# EAGLE design final board (EAGLE 7.6.0)
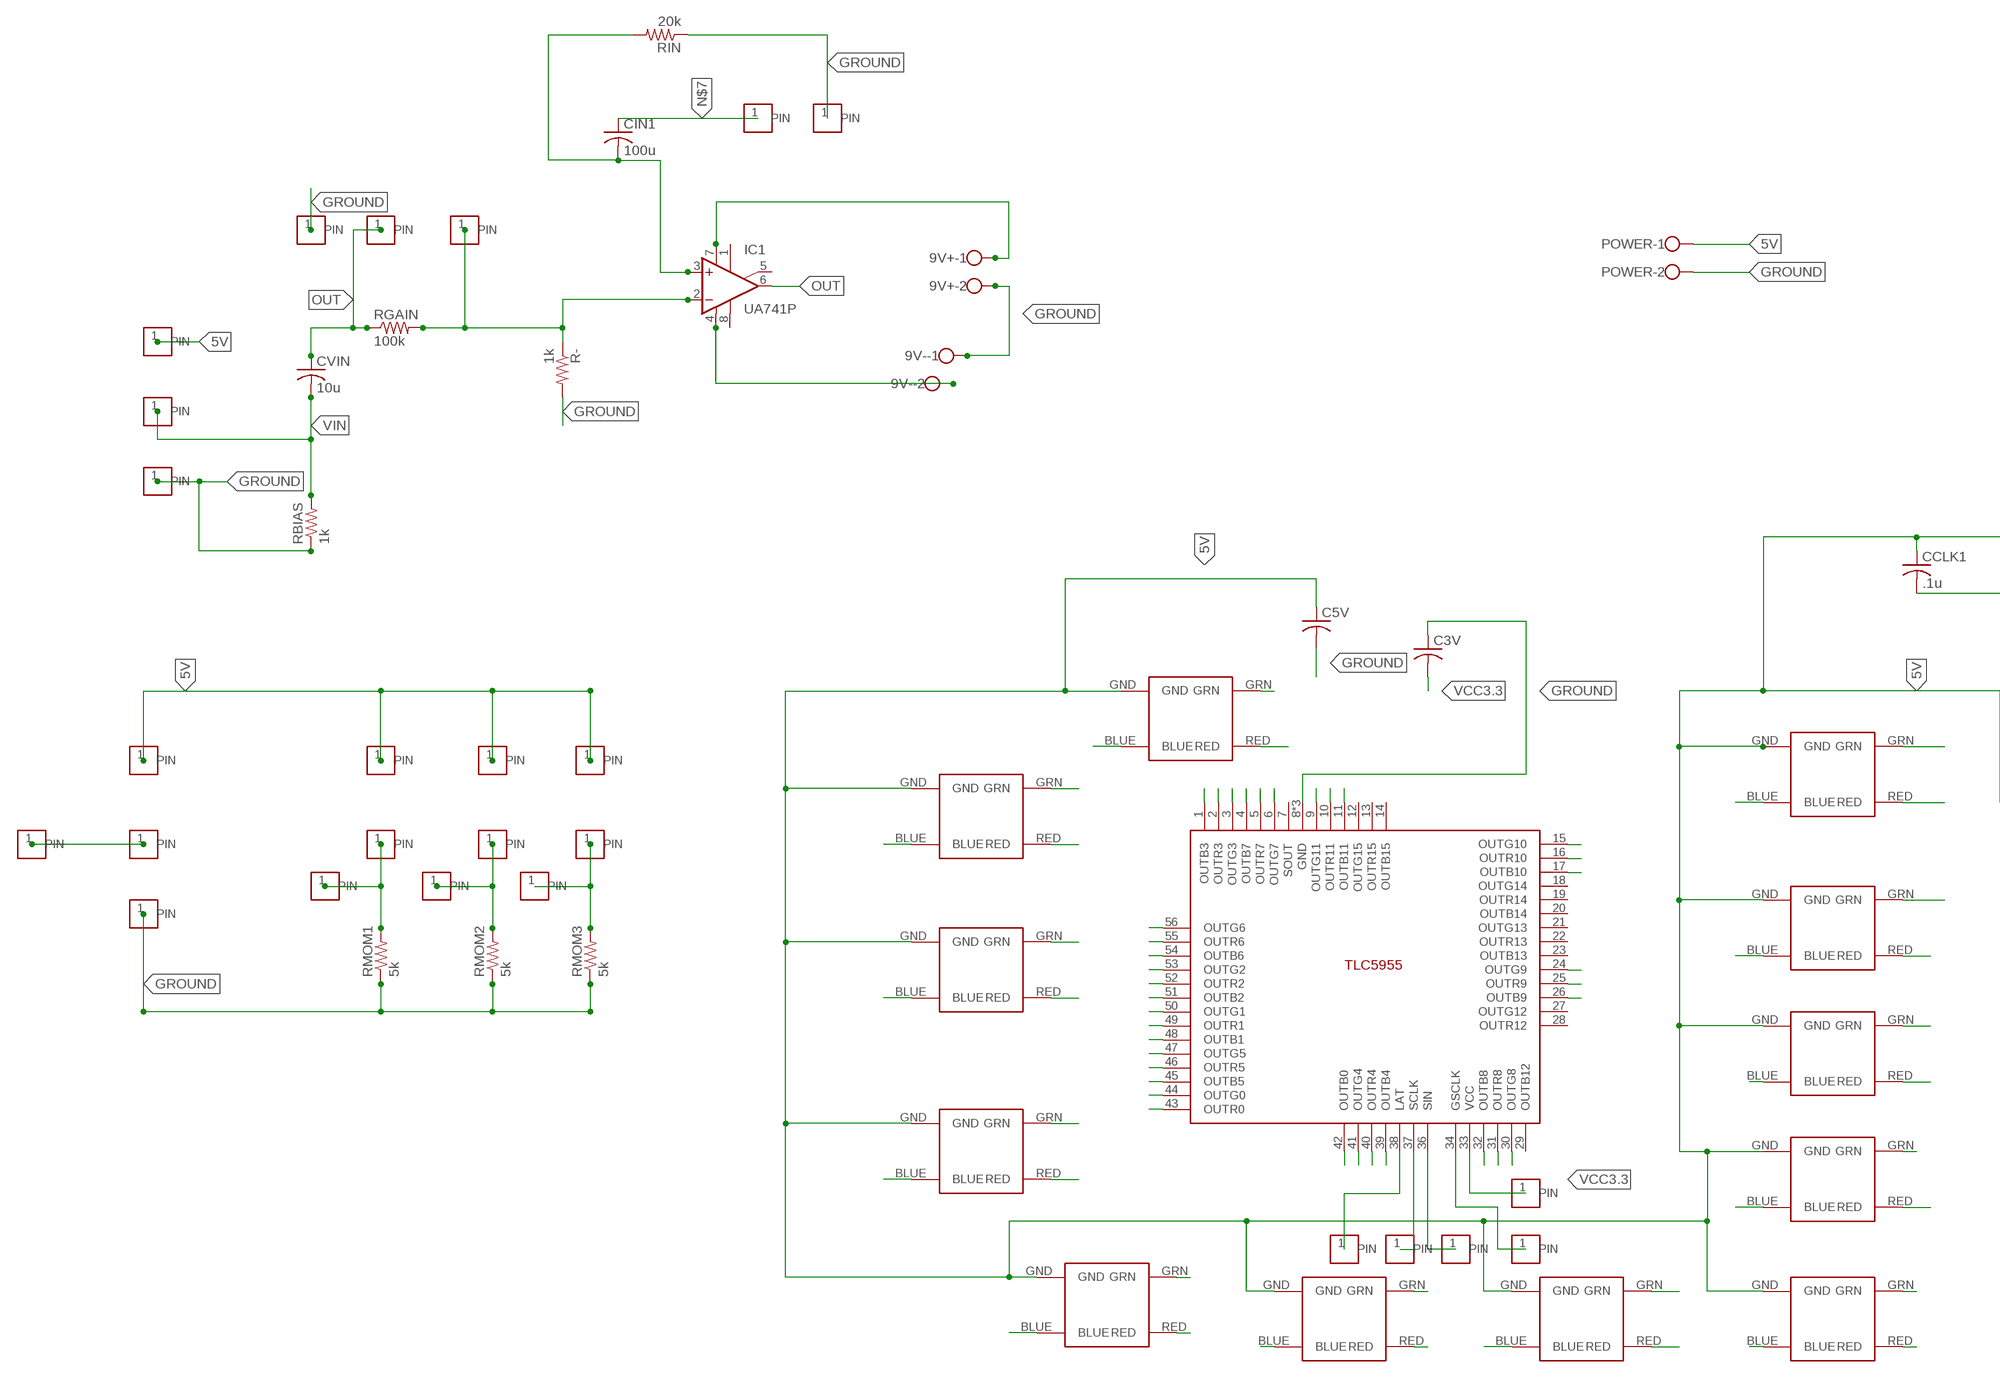
[diagram p0: schematic, sheet 1, part 1 of 2]
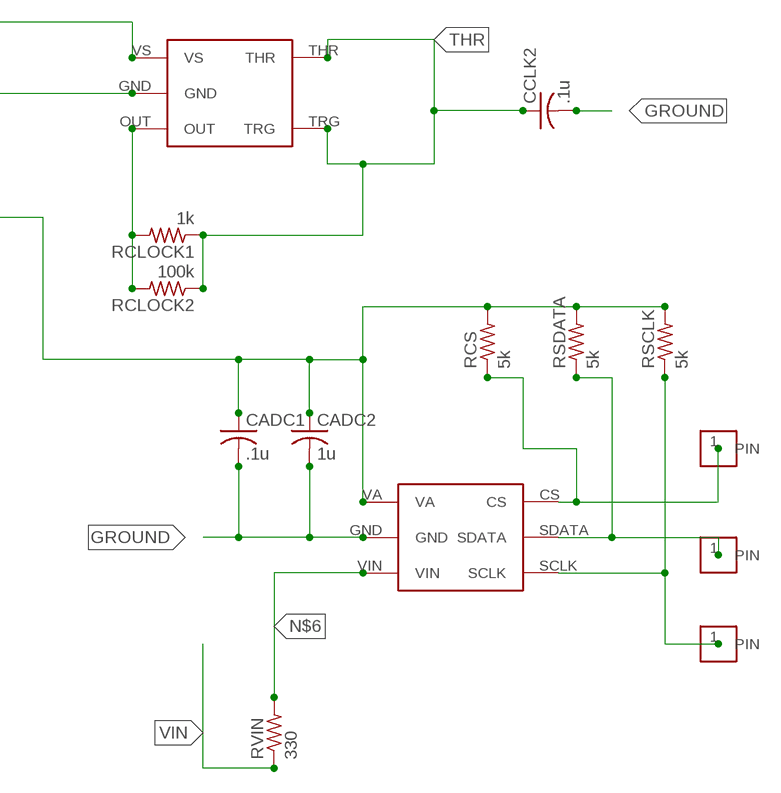
[diagram p1: schematic, sheet 1, part 2 of 2]

## Parts
3.3V  HEADERPIN_1  [HEADERPIN_1]
9V+  W237-102  [W237-102]
9V-  W237-102  [W237-102]
C3V  C-USC0805  [C0805]
C5V  C-USC0805  [C0805]
CADC1  .1u  C-USC0805  [C0805]
CADC2  1u  C-USC0805  [C0805]
CCLK1  .1u  C-USC0805  [C0805]
CCLK2  .1u  C-USC0805  [C0805]
CIN1  100u  C-USC0805  [C0805]
CS  HEADERPIN_1  [HEADERPIN_1]
CVIN  10u  C-USC0805  [C0805]
DATA  HEADERPIN_1  [HEADERPIN_1]
GSCLK  HEADERPIN_1  [HEADERPIN_1]
IC1  UA741P  [DIL08]
INPUTGND  HEADERPIN_1  [HEADERPIN_1]
INPUTV  HEADERPIN_1  [HEADERPIN_1]
INT1  HEADERPIN_1  [HEADERPIN_1]
INT2  HEADERPIN_1  [HEADERPIN_1]
INT3  HEADERPIN_1  [HEADERPIN_1]
LAT  HEADERPIN_1  [HEADERPIN_1]
MOMA1  HEADERPIN_1  [HEADERPIN_1]
MOMA2  HEADERPIN_1  [HEADERPIN_1]
MOMA3  HEADERPIN_1  [HEADERPIN_1]
MOMB1  HEADERPIN_1  [HEADERPIN_1]
MOMB2  HEADERPIN_1  [HEADERPIN_1]
MOMB3  HEADERPIN_1  [HEADERPIN_1]
POTAMPGND  HEADERPIN_1  [HEADERPIN_1]
POTAMPVAL  HEADERPIN_1  [HEADERPIN_1]
POTAMPVCC  HEADERPIN_1  [HEADERPIN_1]
POTBIAS5V  HEADERPIN_1  [HEADERPIN_1]
POTBIASGND  HEADERPIN_1  [HEADERPIN_1]
POTBIASVAL  HEADERPIN_1  [HEADERPIN_1]
POTLVL5V  HEADERPIN_1  [HEADERPIN_1]
POTLVLGND  HEADERPIN_1  [HEADERPIN_1]
POTLVLVAL  HEADERPIN_1  [HEADERPIN_1]
POTLVLVAL2  HEADERPIN_1  [HEADERPIN_1]
POWER  W237-102  [W237-102]
R-  1k  R-US_M0805  [M0805]
RBIAS  1k  R-US_M0805  [M0805]
RCLOCK1  1k  R-US_M0805  [M0805]
RCLOCK2  100k  R-US_M0805  [M0805]
RCS  5k  R-US_M0805  [M0805]
RGAIN  100k  R-US_M0805  [M0805]
RIN  20k  R-US_M0805  [M0805]
RMOM1  5k  R-US_M0805  [M0805]
RMOM2  5k  R-US_M0805  [M0805]
RMOM3  5k  R-US_M0805  [M0805]
RSCLK  5k  R-US_M0805  [M0805]
RSDATA  5k  R-US_M0805  [M0805]
RVIN  330  R-US_M0805  [M0805]
SCLK  HEADERPIN_1  [HEADERPIN_1]
SIN  HEADERPIN_1  [HEADERPIN_1]
SLK  HEADERPIN_1  [HEADERPIN_1]
TLC5955  TLC5954  [TLC5955]
U$1  MIC1555  [SOT-23]
U$2  KINGSBRIGHT_LED_3.5X2.8  [KINGSBRIGHT_LED_3.5X2.8]
U$3  KINGSBRIGHT_LED_3.5X2.8  [KINGSBRIGHT_LED_3.5X2.8]
U$4  KINGSBRIGHT_LED_3.5X2.8  [KINGSBRIGHT_LED_3.5X2.8]
U$5  KINGSBRIGHT_LED_3.5X2.8  [KINGSBRIGHT_LED_3.5X2.8]
U$6  KINGSBRIGHT_LED_3.5X2.8  [KINGSBRIGHT_LED_3.5X2.8]
U$7  KINGSBRIGHT_LED_3.5X2.8  [KINGSBRIGHT_LED_3.5X2.8]
U$8  KINGSBRIGHT_LED_3.5X2.8  [KINGSBRIGHT_LED_3.5X2.8]
U$9  KINGSBRIGHT_LED_3.5X2.8  [KINGSBRIGHT_LED_3.5X2.8]
U$10  KINGSBRIGHT_LED_3.5X2.8  [KINGSBRIGHT_LED_3.5X2.8]
U$11  KINGSBRIGHT_LED_3.5X2.8  [KINGSBRIGHT_LED_3.5X2.8]
U$12  KINGSBRIGHT_LED_3.5X2.8  [KINGSBRIGHT_LED_3.5X2.8]
U$13  KINGSBRIGHT_LED_3.5X2.8  [KINGSBRIGHT_LED_3.5X2.8]
U$14  ADC121S101  [SOT-23(6)]

## Nets
5V: C5V.1 CADC1.1 CADC2.1 CCLK1.1 MOMA1.1(PIN) MOMA2.1(PIN) MOMA3.1(PIN) POTBIAS5V.1(PIN) POTLVL5V.1(PIN) POWER.1 RCS.2 RSCLK.2 RSDATA.2 U$1.VS U$2.GND U$3.GND U$4.GND U$5.GND U$6.GND U$7.GND U$8.GND U$9.GND U$10.GND U$11.GND U$12.GND U$13.GND U$14.VA
B0: TLC5955.42(OUTB0) U$13.BLUE
B1: TLC5955.48(OUTB1) U$12.BLUE
B2: TLC5955.51(OUTB2) U$11.BLUE
B3: TLC5955.1(OUTB3) U$10.BLUE
B4: TLC5955.39(OUTB4) U$9.BLUE
B5: TLC5955.45(OUTB5) U$8.BLUE
B6: TLC5955.54(OUTB6) U$7.BLUE
B7: TLC5955.4(OUTB7) U$6.BLUE
B8: TLC5955.32(OUTB8) U$5.BLUE
B9: TLC5955.26(OUTB9) U$4.BLUE
B10: TLC5955.17(OUTB10) U$3.BLUE
B11: TLC5955.11(OUTB11) U$2.BLUE
G0: TLC5955.44(OUTG0) U$13.GRN
G1: TLC5955.50(OUTG1) U$12.GRN
G2: TLC5955.53(OUTG2) U$11.GRN
G3: TLC5955.3(OUTG3) U$10.GRN
G4: TLC5955.41(OUTG4) U$9.GRN
G5: TLC5955.47(OUTG5) U$8.GRN
G6: TLC5955.56(OUTG6) U$7.GRN
G7: TLC5955.6(OUTG7) U$6.GRN
G8: TLC5955.30(OUTG8) U$5.GRN
G9: TLC5955.24(OUTG9) U$4.GRN
G10: TLC5955.15(OUTG10) U$3.GRN
G11: TLC5955.9(OUTG11) U$2.GRN
GROUND: 9V+.2 9V-.1 C3V.1 C5V.2 CADC1.2 CADC2.2 CCLK1.2 CCLK2.2 INPUTGND.1(PIN) POTAMPGND.1(PIN) POTBIASGND.1(PIN) POTLVLGND.1(PIN) POWER.2 R-.2 RBIAS.1 RIN.1 RMOM1.1 RMOM2.1 RMOM3.1 TLC5955.8(GND) TLC5955.35(GND) TLC5955.HEATSINK(GND) U$1.GND U$14.GND
GSCLK: GSCLK.1(PIN) RCLOCK1.2 RCLOCK2.2 TLC5955.34(GSCLK) U$1.OUT
LAT: LAT.1(PIN) TLC5955.38(LAT)
N$1: CS.1(PIN) RCS.1 U$14.CS
N$2: INT1.1(PIN) MOMB1.1(PIN) RMOM1.2
N$3: RSCLK.1 SLK.1(PIN) U$14.SCLK
N$4: 9V+.1 IC1.7(V+)
N$5: 9V-.2 IC1.4(V-)
N$6: RVIN.2 U$14.VIN
N$7: CIN1.1 INPUTV.1(PIN)
N$8: CIN1.2 IC1.3(+IN) RIN.2
N$9: IC1.2(-IN) POTAMPVCC.1(PIN) R-.1 RGAIN.2
N$10: INT2.1(PIN) MOMB2.1(PIN) RMOM2.2
N$11: INT3.1(PIN) MOMB3.1(PIN) RMOM3.2
N$13: POTLVLVAL2.1(PIN) POTLVLVAL.1(PIN)
OUT: CVIN.1 IC1.6(OUT) POTAMPVAL.1(PIN) RGAIN.1
R0: TLC5955.43(OUTR0) U$13.RED
R1: TLC5955.49(OUTR1) U$12.RED
R2: TLC5955.52(OUTR2) U$11.RED
R3: TLC5955.2(OUTR3) U$10.RED
R4: TLC5955.40(OUTR4) U$9.RED
R5: TLC5955.46(OUTR5) U$8.RED
R6: TLC5955.55(OUTR6) U$7.RED
R7: TLC5955.5(OUTR7) U$6.RED
R8: TLC5955.31(OUTR8) U$5.RED
R9: TLC5955.25(OUTR9) U$4.RED
R10: TLC5955.16(OUTR10) U$3.RED
R11: TLC5955.10(OUTR11) U$2.RED
SCLK: SCLK.1(PIN) TLC5955.37(SCLK)
SDATA: DATA.1(PIN) RSDATA.1 U$14.SDATA
SIN: SIN.1(PIN) TLC5955.36(SIN)
THR: CCLK2.1 RCLOCK1.1 RCLOCK2.1 U$1.THR U$1.TRG
VCC3.3: 3.3V.1(PIN) C3V.2 TLC5955.33(VCC)
VIN: CVIN.2 POTBIASVAL.1(PIN) RBIAS.2 RVIN.1
Unconnected: IC1.1(ON1) IC1.5(ON2) IC1.8(OPT) TLC5955.7(SOUT) TLC5955.12(OUTG15) TLC5955.13(OUTR15) TLC5955.14(OUTB15) TLC5955.18(OUTG14) TLC5955.19(OUTR14) TLC5955.20(OUTB14) TLC5955.21(OUTG13) TLC5955.22(OUTR13) TLC5955.23(OUTB13) TLC5955.27(OUTG12) TLC5955.28(OUTR12) TLC5955.29(OUTB12)

## Library data of the parts
3.3V CS DATA GSCLK INPUTGND INPUTV INT1-INT3 LAT MOMA1-MOMA3 MOMB1-MOMB3 POTAMPGND POTAMPVAL POTAMPVCC POTBIAS5V POTBIASGND POTBIASVAL POTLVL5V POTLVLGND POTLVLVAL POTLVLVAL2 SCLK SIN SLK = HEADERPIN_1:HEADERPIN_1
9V+ 9V- POWER = con-wago-500:W237-102: WAGO SCREW CLAMP; MPN: 237-102; OC_FARNELL: unknown; OC_NEWARK: 70K9898
C3V C5V CADC1 CADC2 CCLK1 CCLK2 CIN1 CVIN = rcl:C-US: CAPACITOR, American symbol
IC1 = linear:*741: OP AMP
R- RBIAS RCLOCK1 RCLOCK2 RCS RGAIN RIN RMOM1-RMOM3 RSCLK RSDATA RVIN = resistor:R-US_: RESISTOR, American symbol
TLC5955 = TLC5955:TLC5954
U$1 = TLC5955:MIC1555
U$2-U$13 = KINGSBRIGHT_LED_3.5X2.8:KINGSBRIGHT_LED_3.5X2.8
U$14 = TLC5955:ADC121S101

## Board
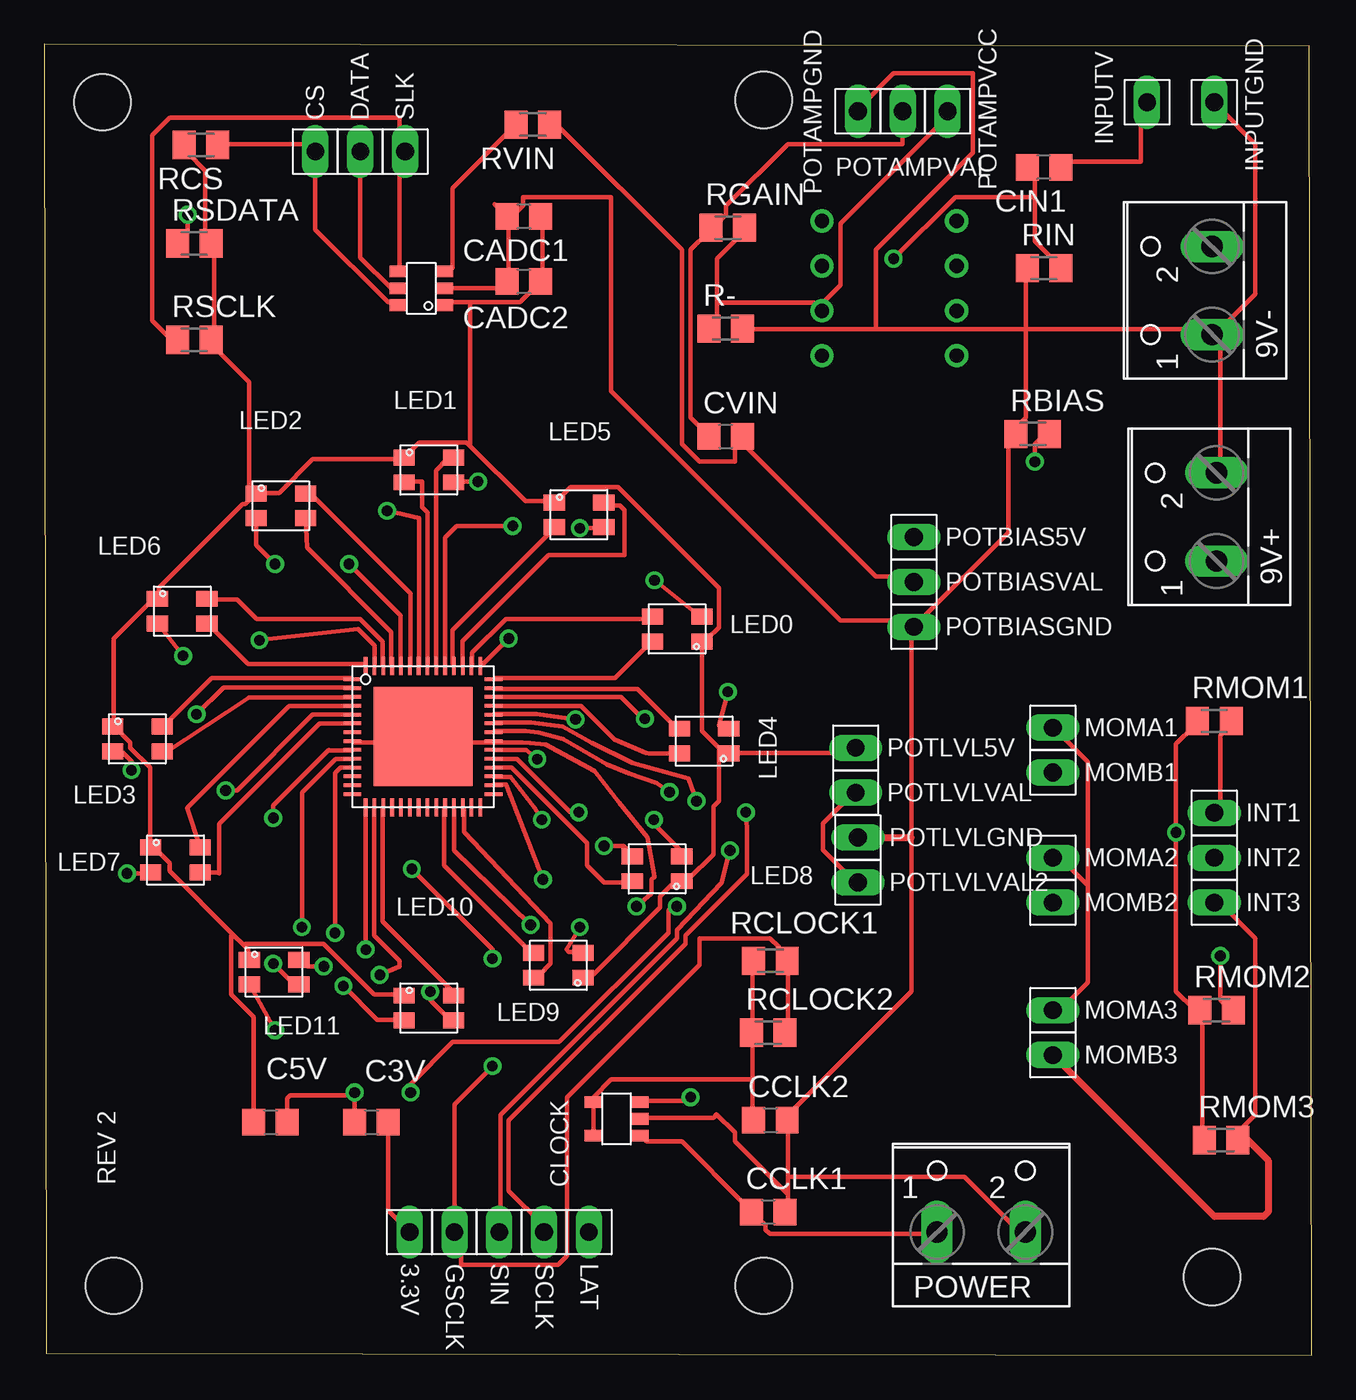
[diagram p2: board, top side]
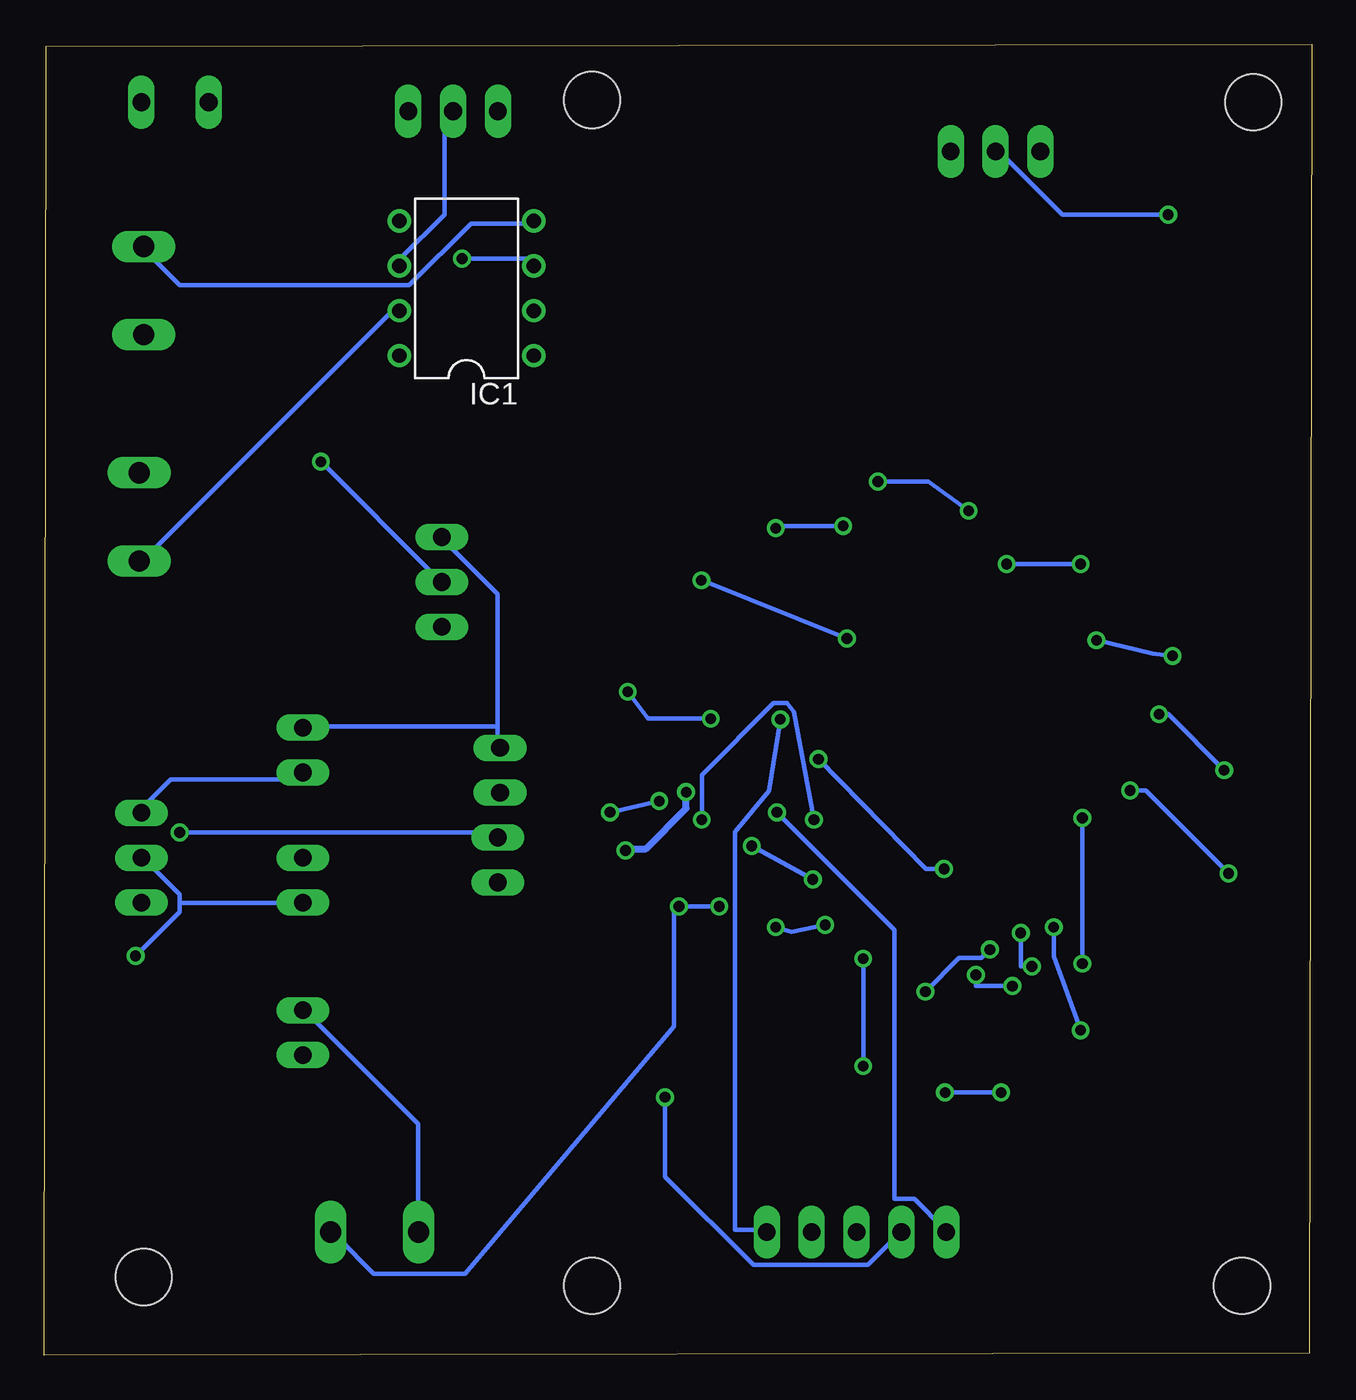
[diagram p3: board, bottom side, seen from below]

Size 71.81 x 74.28 mm. Coordinates in mm from the lower left corner, seen from the top.
Outline: 0.13,0.13 71.81,0 71.68,74.16 0,74.28 0.13,0.13
Copper layers (1*16): Top 0.035mm / dielectric 1.5mm / Bottom 0.035mm
Design rules "default": minimum track width 10mil, minimum drill 24mil, track to track 8mil, track to pad 8mil, pad to pad 8mil, via to via 8mil, smd to smd 8mil, copper to edge 40mil, drill to drill 8mil, minimum pad ring 10mil, minimum via ring 8mil, stop-mask expansion 4mil, vias tented up to drill 0mil, thermal gap 10mil
Holes 3.2 mm at 3.3,70.99 3.94,3.94 40.77,3.94 40.77,71.12 66.17,4.44

### Footprints (pad centres in the part's own frame; a part is rotated, then mirrored left to right if it is on the bottom)
HEADERPIN_1 = drill 1 long: 1 0,0
W237-102 = drill 1.194 long: 1 -2.5,-1.27; 2 2.5,-1.27
C0805 = smd 1.3 x 1.5: 1 -0.95,0; 2 0.95,0
DIL08 = drill 0.813 pad 1.27: 1 -3.81,-3.81; 2 -1.27,-3.81; 3 1.27,-3.81; 4 3.81,-3.81; 5 3.81,3.81; 6 1.27,3.81; 7 -1.27,3.81; 8 -3.81,3.81
M0805 = smd 1.3 x 1.6: 1 -0.95,0; 2 0.95,0
TLC5955 = smd 1.016 x 0.203: 1 -4,3.25; 2 -4,2.75; 3 -4,2.25; 4 -4,1.75; 5 -4,1.25; 6 -4,0.75; 7 -4,0.25; 8 -4,-0.25; 9 -4,-0.75; 10 -4,-1.25; 11 -4,-1.75; 12 -4,-2.25; 13 -4,-2.75; 14 -4,-3.25; 29 4,-3.25; 30 4,-2.75; 31 4,-2.25; 32 4,-1.75; 33 4,-1.25; 34 4,-0.75; 35 4,-0.25; 36 4,0.25; 37 4,0.75; 38 4,1.25; 39 4,1.75; 40 4,2.25; 41 4,2.75; 42 4,3.25 | smd 0.203 x 1.016: 15 -3.25,-4; 16 -2.75,-4; 17 -2.25,-4; 18 -1.75,-4; 19 -1.25,-4; 20 -0.75,-4; 21 -0.25,-4; 22 0.25,-4; 23 0.75,-4; 24 1.25,-4; 25 1.75,-4; 26 2.25,-4; 27 2.75,-4; 28 3.25,-4; 43 3.25,4; 44 2.75,4; 45 2.25,4; 46 1.75,4; 47 1.25,4; 48 0.75,4; 49 0.25,4; 50 -0.25,4; 51 -0.75,4; 52 -1.25,4; 53 -1.75,4; 54 -2.25,4; 55 -2.75,4; 56 -3.25,4 | smd 5.6 x 5.6: HEATSINK 0,0
SOT-23 = smd 1 x 0.66: GND -2.107,0.95; OUT -2.107,0; THR 0.507,1.9; TRG 0.507,0; VS -2.107,1.9
KINGSBRIGHT_LED_3.5X2.8 = smd 1.2 x 0.9: BLUE 3,-0.7; GND 0.2,-0.7; GRN 3,-2.1; RED 0.2,-2.1
SOT-23(6) = smd 1 x 0.66: CS 0.507,0.95; GND -2.107,0; SCLK 0.507,-0.95; SDATA 0.507,0; VA -2.107,0.95; VIN -2.107,-0.95

### Placement (x,y rotation side)
3.3V  20.7,6.98 0 top
9V+  65.15,47.5 90 top
9V-  64.9,60.33 90 top
C3V  18.54,13.21 0 top
C5V  12.83,13.21 0 top
CADC1  27.18,64.52 180 top
CADC2  27.18,60.83 180 top
CCLK1  41.02,8.13 0 top
CCLK2  41.15,13.34 0 top
CIN1  56.64,67.31 180 top
CS  15.37,68.2 180 top
CVIN  38.61,52.07 0 top
DATA  17.91,68.2 180 top
GSCLK  23.24,6.98 0 top
IC1  47.88,60.45 90 bottom
INPUTGND  66.29,70.99 180 top
INPUTV  62.48,70.99 180 top
INT1  66.29,30.73 90 top
INT2  66.29,28.19 90 top
INT3  66.29,25.65 90 top
LAT  30.86,6.98 0 top
MOMA1  57.15,35.56 90 top
MOMA2  57.15,28.19 90 top
MOMA3  57.15,19.56 90 top
MOMB1  57.15,33.02 90 top
MOMB2  57.15,25.65 90 top
MOMB3  57.15,17.02 90 top
POTAMPGND  46.1,70.48 180 top
POTAMPVAL  48.64,70.48 180 top
POTAMPVCC  51.18,70.48 180 top
POTBIAS5V  49.28,46.36 90 top
POTBIASGND  49.28,41.28 90 top
POTBIASVAL  49.28,43.82 90 top
POTLVL5V  45.97,34.42 90 top
POTLVLGND  46.1,29.34 90 top
POTLVLVAL  45.97,31.88 90 top
POTLVLVAL2  46.1,26.8 90 top
POWER  53.09,8.26 0 top
R-  38.61,58.17 0 top
RBIAS  56.01,52.2 0 top
RCLOCK1  41.15,22.35 0 top
RCLOCK2  41.02,18.29 0 top
RCS  8.89,68.58 180 top
RGAIN  38.73,63.88 0 top
RIN  56.64,61.6 0 top
RMOM1  66.29,35.94 0 top
RMOM2  66.42,19.56 0 top
RMOM3  66.67,12.19 0 top
RSCLK  8.51,57.53 0 top
RSDATA  8.51,62.99 0 top
RVIN  27.69,69.72 180 top
SCLK  28.32,6.98 0 top
SIN  25.78,6.98 0 top
SLK  20.45,68.2 180 top
TLC5955  21.46,35.05 0 top
U$1  31.62,14.35 180 top
U$2  11.43,23.11 0 top
U$3  20.19,21.08 0 top
U$4  30.73,20.7 180 top
U$5  36.32,26.16 180 top
U$6  5.84,29.46 0 top
U$7  6.22,43.56 0 top
U$8  28.7,49.02 0 top
U$9  38.99,33.4 180 top
U$10  3.68,36.32 0 top
U$11  11.81,49.53 0 top
U$12  20.19,51.56 0 top
U$13  37.47,39.75 180 top
U$14  20.57,60.45 180 top

### Tracks (layer width: path | path; a pad name or v marks a point on that pad's centre or on a via)
5V
  Top 0.254: 33.78,12.35 U$1.VS 34.13,12.13 36.13,12.13 39.63,8.63 CCLK1.1 40.13,8.13 40.88,7.38 40.88,7.13 41.13,6.88 50.38,6.88 POWER.1 | U$9.GND 38.7,34.26 38.39,34.26 37.28,35.37 U$13.GND 37.28,40.61 37.59,40.61 38.23,41.24 38.23,43.47 32.51,49.18 29.81,49.18 29.02,48.39 U$8.GND 28.86,48.39 27.27,48.39 24.08,51.58 | U$4.GND 30.61,21.56 31.08,21.56 34.89,25.37 34.89,26 35.69,26.8 36,26.8 U$5.GND 36.16,26.96 36.48,26.96 37.91,28.38 37.91,31.08 38.23,31.4 38.23,34.26 U$9.GND | U$11.GND 12.03,48.86 13.3,48.86 15.21,50.77 20.29,50.77 U$12.GND 20.45,50.93 21.24,51.72 23.94,51.72 24.08,51.58 | 12.03,13.15 C5V.1 11.88,13.3 11.88,19.18 10.6,20.45 10.6,23.78 10.68,23.86 | 3.94,35.69 3.94,40.61 6.32,42.99 U$7.GND 6.48,42.99 6.48,43.47 11.24,48.23 11.4,48.23 11.88,48.71 U$11.GND | 3.94,35.69 4.89,34.73 4.89,34.42 6,33.31 6,28.86 U$6.GND 6.16,28.86 7.11,27.91 7.11,27.43 10.68,23.86 | 3.94,35.69 U$10.GND | 10.68,23.86 11.32,23.22 | 11.32,23.22 11.56,22.99 11.56,22.51 U$2.GND | U$3.GND 20.29,20.45 18.7,20.45 15.84,23.3 11.4,23.3 11.32,23.22 | 24.13,59.66 26.96,59.66 28.07,60.77 CADC2.1 28.23,60.93 28.23,64.42 CADC1.1 28.07,64.58 | 24.13,59.66 22.83,59.66 U$14.VA | 59.13,26.63 59.13,21.13 57.63,19.63 MOMA3.1 | 59.13,26.63 57.63,28.13 MOMA2.1 | 59.13,26.63 59.13,33.63 57.63,35.13 MOMA1.1 | RCS.2 8.13,68.13 9.13,67.13 9.13,63.13 RSDATA.2 9.63,62.63 9.63,57.63 RSCLK.2 9.63,57.13 11.63,55.13 11.63,49.13 U$11.GND | POTLVL5V.1 45.63,34.13 39.13,34.13 U$9.GND | 24.13,59.66 24.13,51.63 24.08,51.58
  Bottom 0.254: POWER.1 50.63,7.13 50.63,13.13 57.13,19.63 MOMA3.1 | 46.13,35.63 46.13,34.63 POTLVL5V.1 | 46.13,35.63 46.13,43.13 49.13,46.13 POTBIAS5V.1 | 46.13,35.63 57.13,35.63 MOMA1.1
B0
  Top 0.254: TLC5955.42 25.53,38.39 32.35,38.39 34.42,40.45 U$13.BLUE
B1
  Top 0.254: TLC5955.48 22.19,39.18 22.19,50.13 22.83,50.77 23.15,50.77 U$12.BLUE
B2
  Top 0.254: TLC5955.51 20.76,39.18 20.76,43.15 15.21,48.71 14.89,48.71 U$11.BLUE
B3
  Top 0.254: TLC5955.1 17.43,38.39 9.49,38.39 6.79,35.69 U$10.BLUE
B4
  Top 0.254: TLC5955.39 25.53,36.8 30.42,36.8 32.32,34.89 34.1,34.13 34.26,34.1 35.85,34.1 U$9.BLUE
B5
  Top 0.254: U$8.BLUE 31.89,48.13 32.64,48.13 32.89,47.88 32.89,45.34 28.57,45.34 23.71,40.48 TLC5955.45
B6
  Top 0.254: TLC5955.54 19.18,39.18 19.18,40.45 17.91,41.72 12.03,41.72 10.92,42.83 9.33,42.83 U$7.BLUE
B7
  Top 0.254: TLC5955.4 17.43,36.8 13.88,36.8 8.1,31.02 U$6.BLUE
B8
  Top 0.254: TLC5955.32 25.53,33.31 26.48,33.31 30.77,29.02 30.77,27.75 31.72,26.8 33.31,26.8 U$5.BLUE
B9
  Top 0.254: TLC5955.26 23.78,30.92 23.78,29.65 28.7,24.48 28.7,22.19 28.07,21.56 27.75,21.56 U$4.BLUE
B10
  Top 0.254: TLC5955.17 19.18,30.92 19.18,24.57 23.3,20.45 U$3.BLUE
B11  (via drill 0.61)
  Top 0.254: v16.48,23.94 16.48,32.99 16.8,33.31 17.43,33.31 TLC5955.11 | v15.84,22.03 14.89,22.03 14.57,22.35 U$2.BLUE
  Bottom 0.254: v16.48,23.94 16.48,22.03 v15.84,22.03
G0
  Top 0.254: TLC5955.44 24.26,39.18 24.26,39.82 26.16,41.72 34.42,41.72 U$13.GRN
G1  (via drill 0.61)
  Top 0.254: v19.43,47.85 21.24,47.43 21.24,39.18 TLC5955.50 | v24.57,49.5 23.3,49.5 U$12.GRN
  Bottom 0.254: v19.43,47.85 21.72,49.5 v24.57,49.5
G2
  Top 0.254: TLC5955.53 19.65,39.18 19.65,40.99 14.89,45.75 U$11.GRN
G3
  Top 0.254: TLC5955.3 17.43,37.28 11.62,37.28 6.79,34.1 U$10.GRN
G4
  Top 0.254: TLC5955.41 25.53,37.75 33.62,37.75 35.85,35.53 U$9.GRN
G5  (via drill 0.6)
  Top 0.254: v26.54,46.99 23.37,46.99 22.71,46.34 TLC5955.47 | v30.35,46.86 31.62,46.86 U$8.GRN
  Bottom 0.254: v26.54,46.99 30.1,46.99 v30.35,46.86
G6
  Top 0.254: TLC5955.56 18.22,39.18 11.56,39.18 9.33,41.4 U$7.GRN
G7
  Top 0.254: TLC5955.6 15.61,35.8 9.91,30.1 9.91,27.3 9.85,27.36 U$6.GRN
G8  (via drill 0.61)
  Top 0.254: v28.26,26.96 26.16,32.35 25.53,32.35 TLC5955.30 | v31.72,28.86 32.83,28.86 33.31,28.38 U$5.GRN
  Bottom 0.254: v31.72,28.86 v28.26,26.96
G9
  Top 0.254: TLC5955.24 22.67,30.92 22.67,27.75 27.59,22.83 U$4.GRN
G10  (via drill 0.61)
  Top 0.254: v18.22,22.99 18.22,30.92 TLC5955.15 | v21.88,20.61 21.88,20.13 23.15,18.86 U$3.GRN
  Bottom 0.254: v18.22,22.99 18.7,22.51 19.97,22.51 v21.88,20.61
G11  (via drill 0.61)
  Top 0.254: v12.99,22.19 14.1,21.08 14.41,21.08 U$2.GRN | TLC5955.9 17.43,34.26 16.16,34.26 16.13,34.29 12.99,31.15 v12.99,30.45
  Bottom 0.254: v12.99,22.19 v12.99,30.45
GROUND  (via drill 0.61)
  Top 0.254: 17.51,14.65 17.59,14.57 17.59,13.3 C3V.1 | 17.51,14.65 17.43,14.73 13.94,14.73 13.78,14.57 13.78,13.3 C5V.2 13.78,13.15 | TLC5955.8 17.59,34.73 19.49,34.73 19.81,35.05 TLC5955.HEATSINK 23.15,35.05 23.46,34.73 25.37,34.73 TLC5955.35 25.53,34.73 27.11,34.73 27.53,34.7 28.42,34.61 31.18,33.12 32.58,31.34 34.2,29.34 34.58,27.11 34.42,26.96 34.42,26.16 v33.56,25.43 | v17.59,14.89 17.59,14.73 17.51,14.65 | v20.76,14.89 20.76,15.37 23.15,17.75 29.18,17.75 35.37,23.94 35.37,25.21 v35.85,25.43 | U$1.GND 33.78,13.46 37.91,13.46 38.1,13.65 39.13,12.63 39.13,12.13 42.13,9.13 | U$14.GND 25.84,60.45 26.16,60.77 CADC2.2 26.32,60.93 26.32,64.42 CADC1.2 | 25.53,65.21 26.16,64.58 CADC1.2 | INPUTGND.1 66.63,70.63 68.63,68.63 68.63,60.13 66.63,58.13 9V-.1 | 9V+.2 66.63,50.13 66.63,57.63 9V-.1 | 42.13,10.13 42.13,13.13 CCLK2.2 42.13,13.63 49.13,20.63 49.13,29.34 49.13,41.13 POTBIASGND.1 | 42.13,10.13 42.13,9.13 | 42.13,9.13 42.13,8.63 CCLK1.2 | 42.13,10.13 52.13,10.13 55.13,7.13 POWER.2 | 55.63,58.13 55.63,61.13 RIN.1 | 55.63,58.13 55.63,53.13 55.13,52.63 RBIAS.1 54.63,52.13 54.63,46.63 49.63,41.63 POTBIASGND.1 | 55.63,58.13 47.13,58.13 | 47.13,58.13 39.63,58.13 R-.2 | 47.13,58.13 47.13,62.63 52.63,68.13 52.63,72.63 48.13,72.63 46.13,70.63 POTAMPGND.1 | CADC1.2 26.63,64.63 27.13,65.13 27.13,65.63 32.13,65.63 32.13,54.63 45.13,41.63 49.13,41.63 POTBIASGND.1 | 55.63,58.13 66.13,58.13 9V-.1 | RMOM3.1 65.63,12.63 65.63,19.13 RMOM2.1 65.13,19.63 64.13,20.63 v64.13,29.63 64.13,34.63 65.13,35.63 RMOM1.1
  Top 0.406: POTLVLGND.1 49.13,29.34
  Bottom 0.254: v20.76,14.89 v17.59,14.89 | v33.56,25.43 v35.85,25.43 36.13,25.13 36.13,18.63 47.97,4.63 53.13,4.63 55.13,6.63 POWER.2 | v64.13,29.63 46.13,29.63 POTLVLGND.1
GSCLK  (via drill 0.6, 0.61)
  Top 0.254: v25.4,16.38 23.24,14.22 GSCLK.1 23.63,6.63 23.63,5.13 29.13,5.13 29.63,5.63 29.63,14.63 37.13,22.13 37.13,23.63 41.13,23.63 41.63,23.13 41.63,22.63 RCLOCK1.2 42.13,22.13 42.13,18.63 RCLOCK2.2 | v25.4,22.48 25.4,22.99 v20.83,27.56 | v27.94,33.78 27.29,34.3 TLC5955.34 | U$1.OUT 33.78,14.41 36.32,14.41 36.58,14.67 v36.63,14.63
  Bottom 0.254: v25.4,16.38 v25.4,22.48 | v20.83,27.56 21.84,27.56 v27.94,33.78 | v36.63,14.63 36.63,10.13 31.63,5.13 25.13,5.13 23.63,6.63 GSCLK.1
LAT  (via drill 0.61)
  Top 0.254: v30.1,36.04 27.91,36.32 25.53,36.32 TLC5955.38
  Bottom 0.254: v30.1,36.04 30.73,31.97 32.67,29.65 32.67,7.11 30.92,7.11 LAT.1
N$1
  Top 0.254: U$14.CS 19.97,59.66 19.49,59.66 15.37,63.79 CS.1 15.13,68.63 10.13,68.63 RCS.1
N$2
  Top 0.254: RMOM1.2 67.13,35.63 66.63,35.13 66.63,31.13 INT1.1
  Bottom 0.254: MOMB1.1 57.63,32.63 64.63,32.63 66.13,31.13 INT1.1
N$3
  Top 0.254: U$14.SCLK 20.13,61.41 20.13,67.75 20.45,68.07 SLK.1 20.13,68.63 20.13,70.13 7.13,70.13 6.13,69.13 6.13,58.63 7.13,57.63 RSCLK.1
N$4
  Bottom 0.254: IC1.7 52.13,59.13 66.13,45.13 9V+.1
N$5
  Bottom 0.254: IC1.4 44.13,64.13 47.63,64.13 51.13,60.63 64.13,60.63 66.13,62.63 9V-.2
N$6
  Top 0.254: RVIN.2 26.63,69.63 23.13,66.13 23.13,61.63 U$14.VIN
N$7
  Top 0.254: CIN1.1 57.63,67.63 62.13,67.63 62.13,70.63 INPUTV.1
N$8  (via drill 0.61)
  Top 0.254: 56.13,65.63 56.13,63.13 57.13,62.13 57.13,61.63 RIN.2 | 56.13,65.63 56.13,67.13 CIN1.2 | v48.13,62.13 51.63,65.63 56.13,65.63
  Bottom 0.254: v48.13,62.13 44.13,62.13 IC1.3
N$9
  Top 0.254: 38.13,59.63 38.13,62.13 39.63,63.63 RGAIN.2 | 38.13,59.63 38.13,58.63 R-.1 | 38.13,59.63 43.63,59.63 IC1.2 44.13,59.63 45.13,60.63 45.13,64.13 51.13,70.13 POTAMPVCC.1
N$10  (via drill 0.61)
  Top 0.254: v66.63,22.63 66.63,20.13 67.13,19.63 RMOM2.2
  Bottom 0.254: v66.63,22.63 64.13,25.13 64.13,25.63 | 64.13,25.63 64.13,26.13 66.13,28.13 INT2.1 | 64.13,25.63 57.63,25.63 MOMB2.1
N$11
  Top 0.254: RMOM3.2 67.63,12.63 68.63,13.63 68.63,23.63 66.63,25.63 INT3.1
  Top 0.406: 67.63,12.63 67.76,12.63 69.34,11.05 69.34,8.13 69.09,7.87 66.29,7.87 MOMB3.1
N$13
  Top 0.254: POTLVLVAL.1 45.63,31.63 44.13,30.13 44.13,28.63 45.63,27.13 POTLVLVAL2.1
OUT
  Top 0.254: CVIN.1 37.63,52.13 36.63,53.13 36.63,62.63 37.63,63.63 RGAIN.1 38.13,64.13 38.63,64.63 38.63,65.13 42.13,68.63 48.63,68.63 48.63,70.13 POTAMPVAL.1
  Bottom 0.254: IC1.6 51.63,62.13 49.13,64.63 49.13,70.13 POTAMPVAL.1
R0  (via drill 0.61)
  Top 0.254: v26.32,40.61 24.73,39.02 TLC5955.43 | v34.58,43.91 37.12,41.88 U$13.RED
  Bottom 0.254: v34.58,43.91 v26.32,40.61
R1
  Top 0.254: TLC5955.49 21.72,39.18 21.72,47.75 21.4,48.07 21.4,49.5 20.45,49.5 U$12.RED
R2  (via drill 0.6)
  Top 0.254: U$11.RED 12.01,45.9 v13.08,44.83 | v17.27,44.83 20.19,41.91 20.19,39.12 TLC5955.52
  Bottom 0.254: v13.08,44.83 v17.27,44.83
R3  (via drill 0.6)
  Top 0.254: v8.64,36.32 10.16,37.85 17.42,37.85 TLC5955.2 | v4.95,33.15 4.95,33.66 4.44,34.16 3.94,34.16 U$10.RED
  Bottom 0.254: v8.64,36.32 8.13,36.32 v4.95,33.15
R4  (via drill 0.6)
  Top 0.254: v34.04,36.07 33.91,36.07 32.68,37.3 TLC5955.40 | v38.73,37.59 38.23,35.69 38.35,35.56 38.73,35.56 U$9.RED
  Bottom 0.254: v34.04,36.07 37.59,36.07 v38.73,37.59
R5
  Top 0.254: TLC5955.46 23.15,39.18 23.15,41.09 28.86,46.8 U$8.RED
R6  (via drill 0.6)
  Top 0.254: v12.19,40.51 17.78,41.15 18.71,40.22 TLC5955.55 | v7.87,39.62 6.48,41.4 U$7.RED
  Bottom 0.254: v12.19,40.51 9.02,39.75 v7.87,39.62
R7  (via drill 0.6)
  Top 0.254: v10.29,32 10.92,32 15.22,36.3 TLC5955.5 | v4.7,27.3 5.97,27.3 U$6.RED
  Bottom 0.254: v10.29,32 9.4,32 v4.7,27.3
R8  (via drill 0.6)
  Top 0.254: 27.94,30.35 v28.19,30.35 27.81,30.99 26.42,32.77 25.5,32.77 TLC5955.31 | v34.54,30.35 34.54,30.1 36.32,28.32 36.2,28.19 U$5.RED
  Bottom 0.254: v28.19,30.35 29.34,36.45 29.72,36.96 30.48,36.96 34.54,32.89 v34.54,30.35
R9  (via drill 0.6)
  Top 0.254: v27.56,24.38 23.21,28.6 TLC5955.25 | v30.35,24.26 29.59,22.99 29.72,22.86 30.48,22.86 U$4.RED
  Bottom 0.254: v27.56,24.38 29.46,24 v30.35,24.26
R10  (via drill 0.61)
  Top 0.254: v19.02,21.56 20.13,22.03 20.13,22.35 18.7,23.78 18.7,30.92 TLC5955.16 | v16.95,20.92 18.86,19.02 20.29,19.02 U$3.RED
  Bottom 0.254: v19.02,21.56 19.02,20.92 v16.95,20.92
R11  (via drill 0.6)
  Top 0.254: v13.08,18.41 11.68,20.95 U$2.RED | v14.61,24.26 14.61,31.88 16.51,33.78 17.44,33.78 TLC5955.10
  Bottom 0.254: v14.61,24.26 14.61,22.61 v13.08,18.41
SCLK  (via drill 0.61)
  Top 0.254: v36.96,31.4 36.51,32.67 33.34,33.56 31.05,34.7 29.37,35.62 27.59,35.85 25.53,35.85 TLC5955.37 | v39.75,30.77 39.82,29.81 39.82,27.27 36.32,23.78 36.32,23.3 26.32,13.3 26.32,9.33 28.23,7.43 28.23,7.11 SCLK.1
  Bottom 0.254: v39.75,30.77 v36.96,31.4
SDATA  (via drill 0.61)
  Top 0.254: U$14.SDATA 19.65,60.45 17.91,62.2 DATA.1 | v8.13,64.63 8.13,63.63 7.63,63.13 RSDATA.1
  Bottom 0.254: v8.13,64.63 14.13,64.63 17.63,68.13 DATA.1
SIN  (via drill 0.61)
  Top 0.254: v35.43,31.91 34.7,32.42 33.15,32.96 31.88,33.46 29.4,34.93 28,35.27 27.27,35.37 25.53,35.37 TLC5955.36 | v38.86,28.61 38.89,28.77 38.39,26.77 35.85,24.1 35.85,23.62 25.84,13.62 25.84,7.11 SIN.1
  Bottom 0.406: v35.43,31.91 35.43,30.99 37.72,28.7 38.86,28.7 v38.86,28.61
THR
  Top 0.254: 31.24,12.35 U$1.THR 31.13,12.63 31.13,14.13 U$1.TRG 31.13,14.63 32.13,15.63 40.13,15.63 | 40.13,15.63 40.13,18.13 RCLOCK2.1 40.13,18.63 40.13,22.13 RCLOCK1.1 | 40.13,15.63 40.13,13.63 CCLK2.1
VCC3.3  (via drill 0.61)
  Top 0.254: v30.29,30.77 29.81,30.77 26.8,33.78 25.53,33.78 TLC5955.33 | C3V.2 19.49,13.15 19.49,8.22 20.61,7.11 3.3V.1
  Bottom 0.254: v30.29,30.77 23.62,24.1 23.62,8.86 22.51,8.86 20.76,7.11 3.3V.1
VIN  (via drill 0.61)
  Top 0.254: POTBIASVAL.1 49.13,44.13 47.13,44.13 39.63,51.63 CVIN.2 39.13,51.63 39.13,50.63 37.13,50.63 36.13,51.63 36.13,62.63 29.13,69.63 RVIN.1 | v56.13,50.63 56.13,51.63 56.63,52.13 RBIAS.2
  Bottom 0.254: v56.13,50.63 49.63,44.13 POTBIASVAL.1

### Text on the board
tPlace: LED1 | LED2 | LED5 | LED6 | LED0 | LED4 | LED3 | LED7 | LED8 | LED10 | LED11 | LED9 | REV 2 | CLOCK